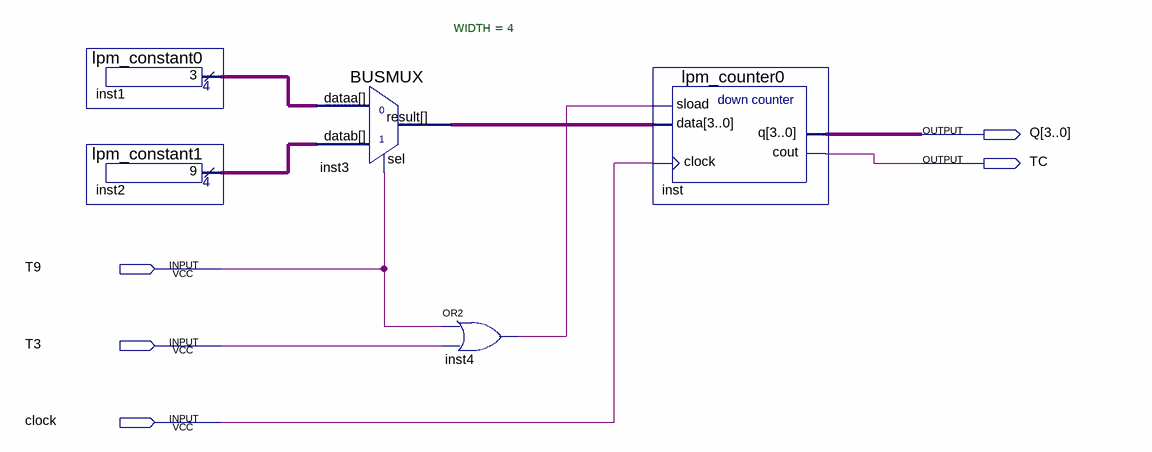
[diagram p0: schematic sheet]
// Quartus schematic timer.bdf as structural Verilog: 5 symbols, 5 pins
module timer (
  input  T9,
  input  T3,
  input  clock,
  output [3:0] Q,
  output TC
);

  wire inst4_out;
  wire [3:0] inst1_result, inst2_result, inst3_result;

  lpm_constant0 inst1 (.result(inst1_result));
  lpm_constant1 inst2 (.result(inst2_result));
  BUSMUX #(.WIDTH(4)) inst3 (.datab(inst2_result), .sel(T9), .dataa(inst1_result), .result(inst3_result));
  or inst4 (inst4_out, T9, T3);
  lpm_counter0 inst (.sload(inst4_out), .data(inst3_result), .clock(clock), .cout(TC), .q(Q));
endmodule
